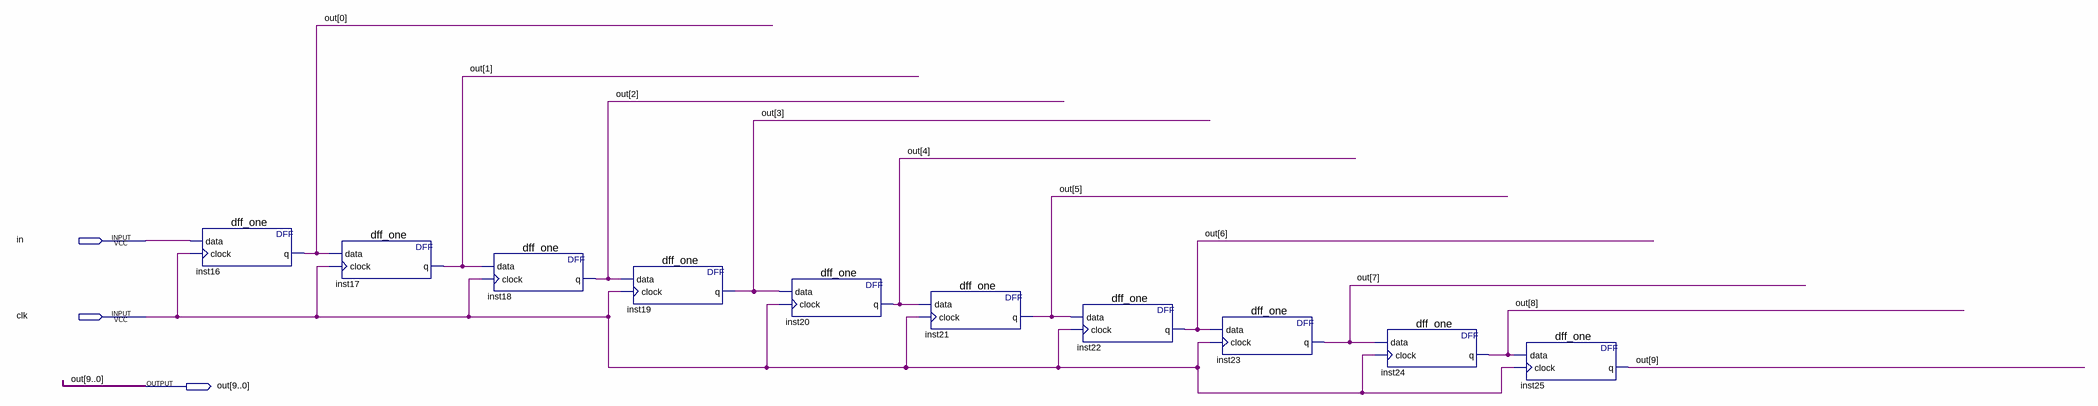
[diagram p0: schematic sheet]
// Quartus schematic tapdel_10.bdf as structural Verilog: 10 symbols, 3 pins
module tapdel_10 (
  input  in,
  input  clk,
  output [9:0] out
);

  dff_one inst16 (.data(in), .clock(clk), .q(out[0]));
  dff_one inst17 (.data(out[0]), .clock(clk), .q(out[1]));
  dff_one inst18 (.data(out[1]), .clock(clk), .q(out[2]));
  dff_one inst19 (.data(out[2]), .clock(clk), .q(out[3]));
  dff_one inst20 (.data(out[3]), .clock(clk), .q(out[4]));
  dff_one inst21 (.data(out[4]), .clock(clk), .q(out[5]));
  dff_one inst22 (.data(out[5]), .clock(clk), .q(out[6]));
  dff_one inst23 (.data(out[6]), .clock(clk), .q(out[7]));
  dff_one inst24 (.data(out[7]), .clock(clk), .q(out[8]));
  dff_one inst25 (.data(out[8]), .clock(clk), .q(out[9]));
endmodule
